# Altium schematic sheet Power_Distribution_2021_12V.SchDoc
size A; SheetNumber: 1; SheetTotal: 3
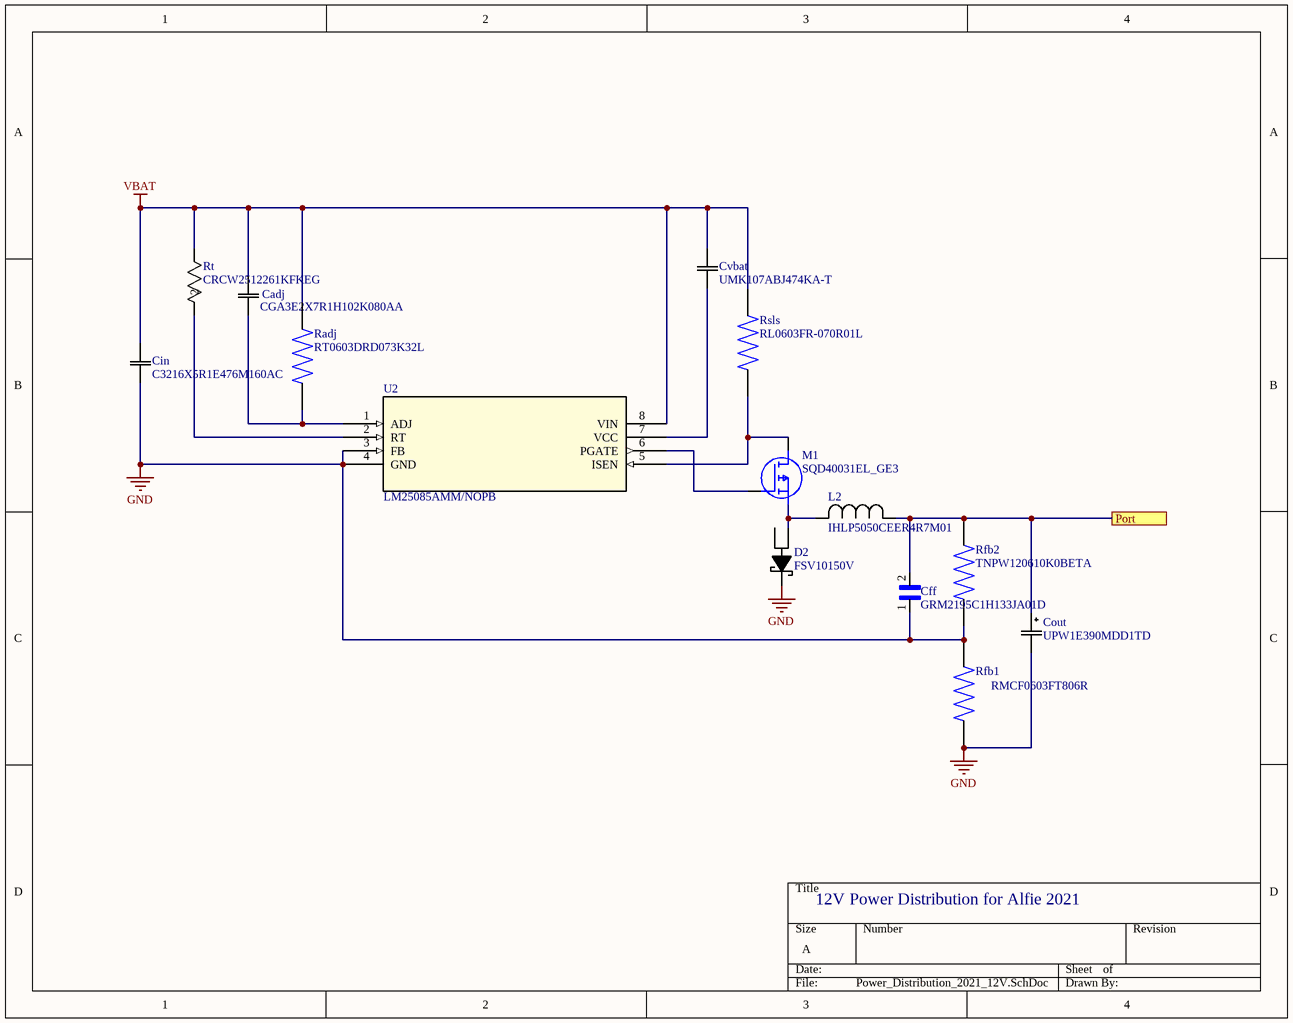
[diagram p0: Power_Distribution_2021_12V.SchDoc]

## Parts
Cadj  CGA3E2X7R1H102K080AA  [CAP_1608_TDK]
Cff  GRM2195C1H133JA01D  [CAPC2012X95N]
Cin  C3216X5R1E476M160AC  [CAP_3216_TDK]
Cout  UPW1E390MDD1TD  [CAP_UEP_5X11_NCH]
Cvbat  UMK107ABJ474KA-T  [cap_UMK107ABJ474KA-T_TAY]
D2  FSV10150V  [TO-277_3L]
L2  IHLP5050CEER4R7M01  [IND_IHLP-5050CE_VIS]
M1  SQD40031EL_GE3  [SQD40031EL_GE3]
Radj  RT0603DRD073K32L  [RESC1608X55N]
Rfb1  RMCF0603FT806R  [RESC1508X55N]
Rfb2  TNPW120610K0BETA  [RESC3216X65N]
Rsls  RL0603FR-070R01L  [RESC1608X55N]
Rt  CRCW2512261KFKEG  [RC2512N_VIS]
U2  LM25085AMM/NOPB  [MUA08A]

## Ports
Port

## Nets
GND: Cff.1 Cin.1 Cout.2 D2.2 Rfb1.1 Rfb1.2 Rfb2.1 U2.3(FB) U2.4(GND)
VBAT: Cadj.2 Cin.2 Cvbat.1 Radj.2 Rsls.2 Rt.1 U2.8(VIN)
Port: Cff.2 Cout.1 L2.1 Rfb2.2 ; port Port
NetCadj_1: Cadj.1 Radj.1 U2.1(ADJ)
NetCvbat_2: Cvbat.2 U2.7(VCC)
NetD2_0: D2.0 L2.2 M1.2(S)
NetM1_1: M1.1(G) U2.6(PGATE)
NetM1_3: M1.3(D) Rsls.1 U2.5(ISEN)
NetRt_2: Rt.2 U2.2(RT)

Not connected (* = marked no-connect by the designer): D2 1

## Notes on the sheet
- 12V Power Distribution for Alfie 2021

## Library data of the parts
Cadj = CGA3E2X7R1H102K080AA: CAP CER 1000PF 50V X7R 0603; Vendor: TDK; Built_By: EMA_UL_Team; SourceLibrary: TDK_2015_05_22; Manufacturer_Part_Number: CGA3E2X7R1H102K080AA; Copyright: Copyright (C) 2021 Accelerated Designs. All rights reserved; RefDes: RefDes; Type: DEV
Cff = GRM2195C1H133JA01D: SMD Capacitor C0G(EIA) with Capacitance: 13000pF Tol. 5%. Rated Voltage: 50Vdc; Package: None; Price: None; Value: *; MP: GRM2195C1H133JA01D; Availability: Unavailable
Cin = C3216X5R1E476M160AC: CAP CER 47UF 25V X5R 1206; Vendor: TDK; Built_By: EMA_UL_Team; SourceLibrary: TDK_2015_05_22; Manufacturer_Part_Number: C3216X5R1E476M160AC; Copyright: Copyright (C) 2021 Accelerated Designs. All rights reserved; RefDes: RefDes; Type: DEV
Cout = UPW1E390MDD1TD: CAP ALUM 39UF 20% 25V RADIAL; Vendor: Nichicon; Built_By: EMA_Cory; SourceLibrary: Nichicon_2019-09-13; Manufacturer_Part_Number: UPW1E390MDD1TD; Copyright: Copyright (C) 2018 Accelerated Designs. All rights reserved; RefDes: RefDes; Type: DEV
Cvbat = UMK107ABJ474KA-T: CAP CER 0.47UF 50V X5R 0603; Vendor: Taiyo Yuden; Built_By: EMA_UL_Team; SourceLibrary: Taiyo_Yuden_2018-10-17; Manufacturer_Part_Number: UMK107ABJ474KA-T; Copyright: Copyright (C) 2018 Accelerated Designs. All rights reserved; RefDes: RefDes; Type: DEV
D2 = FSV10150V: DIODE SCHOTTKY 150V 10A TO277-3
L2 = IHLP5050CEER4R7M01: FIXED IND 4.7UH 10A 15 MOHM SMD; Vendor: VISHAY; Built_By: EMA_UL_Team; SourceLibrary: Vishay_2010-01-01_IND_IHLP; Type: DEV; Manufacturer_Part_Number: IHLP5050CEER4R7M01; Copyright: Copyright (C) 2021 Accelerated Designs. All rights reserved; RefDes: RefDes
M1 = SQD40031EL_GE3: MOSFET (P-Channel); Manufacturer_Name: Vishay; Datasheet Link: https://www.vishay.com/docs/76011/sqd40031el.pdf; Height: 2.38mm; Manufacturer_Part_Number: SQD40031EL_GE3
Radj = RT0603DRD073K32L: RES SMD 3.32KOHM 0.5% 1/10W 0603; Package: None; Price: None; Value: *; MP: RT0603DRD073K32L; Availability: Unavailable
Rfb1 = RMCF0603FT806R: RES 806 OHM 1% 1/10W 0603; Package: None; Price: None; Value: *; MP: RMCF0603FT806R; Availability: Unavailable
Rfb2 = TNPW120610K0BETA: Res Thin Film 1206 10K Ohm 0.1% 0.25W(1/4W) ?25ppm/C Molded SMD T/R; Package: None; Price: None; Value: *; MP: TNPW120610K0BETA; Availability: Unavailable
Rsls = RL0603FR-070R01L: .01 OHM 1% 1/10W; Package: None; Price: None; Value: *; MP: RL0603FR-070R01L; Availability: Unavailable
Rt = CRCW2512261KFKEG: RES SMD 261K OHM 1% 1W 2512; Vendor: Vishay; Built_By: EMA_UL_Team; SourceLibrary: Vishay_2010-01-01_Res1; Manufacturer_Part_Number: CRCW2512261KFKEG; Copyright: Copyright (C) 2021 Accelerated Designs. All rights reserved; RefDes: RefDes; Type: DEV
U2 = LM25085AMM/NOPB: IC REG CTRLR BUCK 8VSSOP; Vendor: National; Manufacturer_Part_Number: LM25085AMM/NOPB; Copyright: Copyright (C) 2021 Accelerated Designs. All rights reserved; RefDes: RefDes; Type: DEV